# EAGLE design simon (EAGLE 6.1)
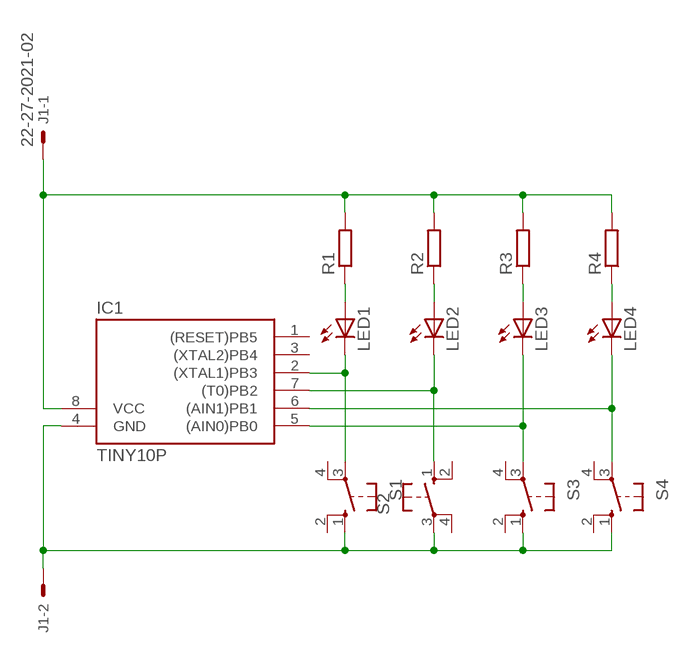
[diagram p0: schematic, sheet 1]

## Parts
IC1  TINY10P  [DIL08]
J1  22-27-2021-02  [6410-02]
LED1  LED3MM  [LED3MM]
LED2  LED3MM  [LED3MM]
LED3  LED3MM  [LED3MM]
LED4  LED3MM  [LED3MM]
R1  R-EU_0204/2V  [0204V]
R2  R-EU_0204/2V  [0204V]
R3  R-EU_0204/2V  [0204V]
R4  R-EU_0204/2V  [0204V]
S1  10-XX  [B3F-10XX]
S2  10-XX  [B3F-10XX]
S3  10-XX  [B3F-10XX]
S4  10-XX  [B3F-10XX]

## Nets
GND: IC1.4(GND) J1.2 S1.1(S) S2.3(P) S3.1(S) S4.1(S)
N$1: IC1.8(VCC) J1.1 R1.2 R2.2 R3.2 R4.2
N$2: LED4.A R4.1
N$3: LED3.A R3.1
N$4: LED2.A R2.1
N$5: LED1.A R1.1
N$6: IC1.2((XTAL1)PB3) LED1.K(C) S1.3(P)
N$7: IC1.7((T0)PB2) LED2.K(C) S2.1(S)
N$8: IC1.5((AIN0)PB0) LED3.K(C) S3.3(P)
N$9: IC1.6((AIN1)PB1) LED4.K(C) S4.3(P)
Unconnected: IC1.1((RESET)PB5) IC1.3((XTAL2)PB4) S1.2(S1) S1.4(P1) S2.2(S1) S2.4(P1) S3.2(S1) S3.4(P1) S4.2(S1) S4.4(P1)

## Library data of the parts
IC1 = atmel:TINY10: MICROCONTROLLER 1 Kbytes ROM; OC_FARNELL: unknown; OC_NEWARK: unknown
J1 = con-molex:22-?-02: CONNECTOR wire to board 2.54 mm (.1 inch) pitch header; OC_FARNELL: unknown; OC_NEWARK: unknown
LED1-LED4 = led:LED: LED OSRAM: - CHIPLED LG R971, LG N971, LY N971, LG Q971, LY Q971, LO R971, LY R971 LH N974, LH R974 LS Q976, LO Q976, LY Q976 LO Q996 - Hyper CHIPLED LW Q18S LB Q993, LB Q99A, LB R99A - SideLED LS A670, LO A670, LY A670, LG A670, LP A670 LB A673, LV A673, LT A673, LW A673 LH A674 LY A675 LS A676, LA A676, LO A676, LY A676, LW A676 LS A679, LY A679, LG A679 - Hyper Micro SIDELED® LS Y876, LA Y876, LO Y876, LY Y876 LT Y87S - SmartLED LW L88C, LW L88S LB L89C, LB L89S, LG L890 LS L89K, LO L89K, LY L89K LS L896, LA L896, LO L896, LY L896 - TOPLED LS T670, LO T670, LY T670, LG T670, LP T670 LSG T670, LSP T670, LSY T670, LOP T670, LYG T670 LG T671, LOG T671, LSG T671 LB T673, LV T673, LT T673, LW T673 LH T674 LS T676, LA T676, LO T676, LY T676, LB T676, LH T676, LSB T676, LW T676 LB T67C, LV T67C, LT T67C, LS T67K, LO T67K, LY T67K, LW E67C LS E67B, LA E67B, LO E67B, LY E67B, LB E67C, LV E67C, LT E67C LW T67C LS T679, LY T679, LG T679 LS T770, LO T770, LY T770, LG T770, LP T770 LB T773, LV T773, LT T773, LW T773 LH T774 LS E675, LA E675, LY E675, LS T675 LS T776, LA T776, LO T776, LY T776, LB T776 LHGB T686 LT T68C, LB T68C - Hyper Mini TOPLED® LB M676 - Mini TOPLED Santana® LG M470 LS M47K, LO M47K, LY M47K Source: http://www.osram.convergy.de LUXEON: - LUMILED® LXK2-PW12-R00, LXK2-PW12-S00, LXK2-PW14-U00, LXK2-PW14-V00 LXK2-PM12-R00, LXK2-PM12-S00, LXK2-PM14-U00 LXK2-PE12-Q00, LXK2-PE12-R00, LXK2-PE12-S00, LXK2-PE14-T00, LXK2-PE14-U00 LXK2-PB12-K00, LXK2-PB12-L00, LXK2-PB12-M00, LXK2-PB14-N00, LXK2-PB14-P00, LXK2-PB14-Q00 LXK2-PR12-L00, LXK2-PR12-M00, LXK2-PR14-Q00, LXK2-PR14-R00 LXK2-PD12-Q00, LXK2-PD12-R00, LXK2-PD12-S00 LXK2-PH12-R00, LXK2-PH12-S00 LXK2-PL12-P00, LXK2-PL12-Q00, LXK2-PL12-R00 Source: www.luxeon.com KINGBRIGHT: KA-3528ASYC Source: www.kingbright.com
R1-R4 = rcl:R-EU_: RESISTOR, European symbol
S1-S4 = switch-omron:10-XX: OMRON SWITCH; MPN: B3F-1000; OC_FARNELL: 176432; OC_NEWARK: 36M3542

## Board
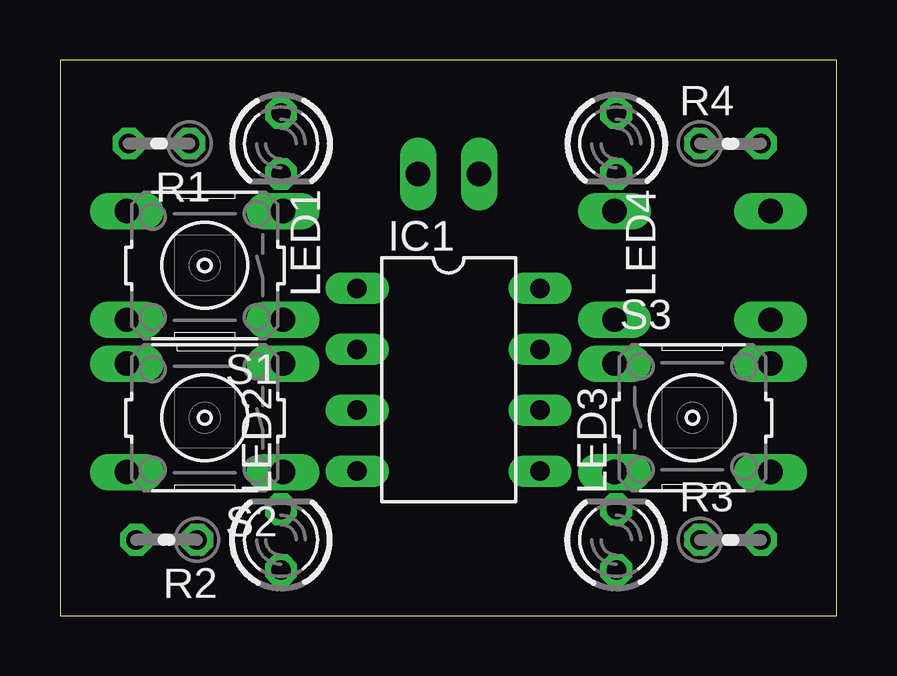
[diagram p1: board, top side]
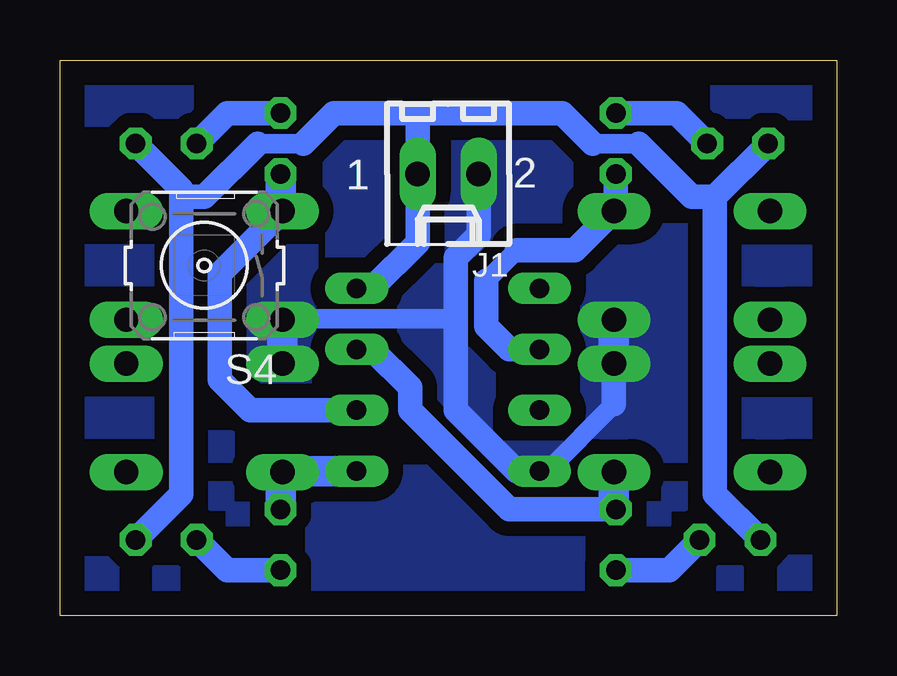
[diagram p2: board, bottom side, seen from below]

Size 32.37 x 23.16 mm. Coordinates in mm from the lower left corner, seen from the top.
Outline: 0,0 32.36,0 32.36,23.16 0,23.16 0,0
Copper layers (1*16): Top 0.035mm / dielectric 1.5mm / Bottom 0.035mm
Design rules: minimum track width 10mil, minimum drill 24mil, track to track 8mil, track to pad 8mil, pad to pad 8mil, via to via 8mil, smd to smd 8mil, copper to edge 40mil, drill to drill 8mil, minimum pad ring 10mil, minimum via ring 8mil, stop-mask expansion 4mil, vias tented up to drill 0mil, thermal gap 10mil

### Footprints (pad centres in the part's own frame; a part is rotated, then mirrored left to right if it is on the bottom)
DIL08 = drill 0.813 long: 1 -3.81,-3.81; 2 -1.27,-3.81; 3 1.27,-3.81; 4 3.81,-3.81; 5 3.81,3.81; 6 1.27,3.81; 7 -1.27,3.81; 8 -3.81,3.81
6410-02 = drill 1.016 long: 1 1.27,0; 2 -1.27,0
LED3MM = drill 0.813 octagon: A -1.27,0; K 1.27,0
0204V = drill 0.813 octagon: 1 -1.27,0; 2 1.27,0
B3F-10XX = drill 1.016 long: 1 -3.251,2.261; 2 3.251,2.261; 3 -3.251,-2.261; 4 3.251,-2.261

### Placement (x,y rotation side)
IC1  16.19,9.84 270 top
J1  16.19,18.41 180 bottom
LED1  9.21,19.68 270 top
LED2  9.21,3.17 90 top
LED3  23.18,3.17 90 top
LED4  23.18,19.68 270 top
R1  4.13,19.68 180 top
R2  4.45,3.17 180 top
R3  27.94,3.17 0 top
R4  27.94,19.68 0 top
S1  6.03,14.61 180 top
S2  6.03,8.26 180 top
S3  26.35,8.26 0 top
S4  26.35,14.61 180 bottom

### Tracks (layer width: path | path; a pad name or v marks a point on that pad's centre or on a via)
GND
  Bottom 0.813: 9.28,8.81 12.07,6.03 | 15.87,12.38 23.06,12.38
  Bottom 1.016: S2.3 9.28,8.81 | 12.07,6.03 IC1.4 13.34,6.03 15.87,8.57 15.87,12.38 15.87,14.92 14.92,15.88 J1.2 | 23.06,12.38 S4.1
  Bottom 1.27: S1.1 S2.3 | S4.1 S3.1
  pour Bottom (isolate 0.61, no thermals): 0,23.18 0,0 32.39,0 32.39,23.18
N$1
  Bottom 0.813: 8.26,19.68 10.16,19.68 | 22.22,19.68 24.13,19.68
  Bottom 1.016: 5.08,17.46 5.08,5.08 R2.2 | 5.08,17.46 6.03,17.46 8.26,19.68 | 27.31,17.46 27.31,5.08 R3.2 | 24.13,19.68 26.35,17.46 27.31,17.46 | 10.16,19.68 11.43,20.95 17.46,20.95 | 22.22,19.68 20.95,20.95 17.78,20.95 | 17.46,20.64 J1.1 17.46,15.56 19.37,13.65 IC1.8 | 17.46,20.95 17.78,20.95 | 17.78,20.95 17.46,20.64 | 17.46,20.64 17.46,20.95 | R4.2 27.31,17.78 27.31,17.46 | 5.08,17.46 R1.2
N$2
  Bottom 1.016: R4.1 25.4,20.95 LED4.A
N$3
  Bottom 1.016: R3.1 25.4,1.91 LED3.A
N$4
  Bottom 1.016: R2.1 6.99,1.91 LED2.A
N$5
  Bottom 1.016: R1.1 6.67,20.95 LED1.A
N$6
  Bottom 0.813: 13.34,15.24 14.6,13.97
  Bottom 1.016: LED1.K 9.21,16.94 | S1.3 10.91,15.24 13.34,15.24 | 14.6,13.97 14.6,12.06 13.65,11.11 IC1.2
  Bottom 1.27: 9.21,16.94 S1.3
N$7
  Bottom 1.016: 9.52,6.03 9.21,6.03 LED2.K 13.65,4.45 17.78,8.57 17.78,9.53 19.37,11.11 IC1.7
  Bottom 1.27: LED2.K 9.28,4.52 S2.1 9.32,6.03 9.52,6.03
N$8
  Bottom 1.27: LED3.K 23.18,5.92 S3.3 23.06,6.03 IC1.5
N$9
  Bottom 1.016: IC1.6 24.45,8.57 25.72,9.84 25.72,14.25 S4.3
  Bottom 1.27: LED4.K 23.18,16.94 S4.3